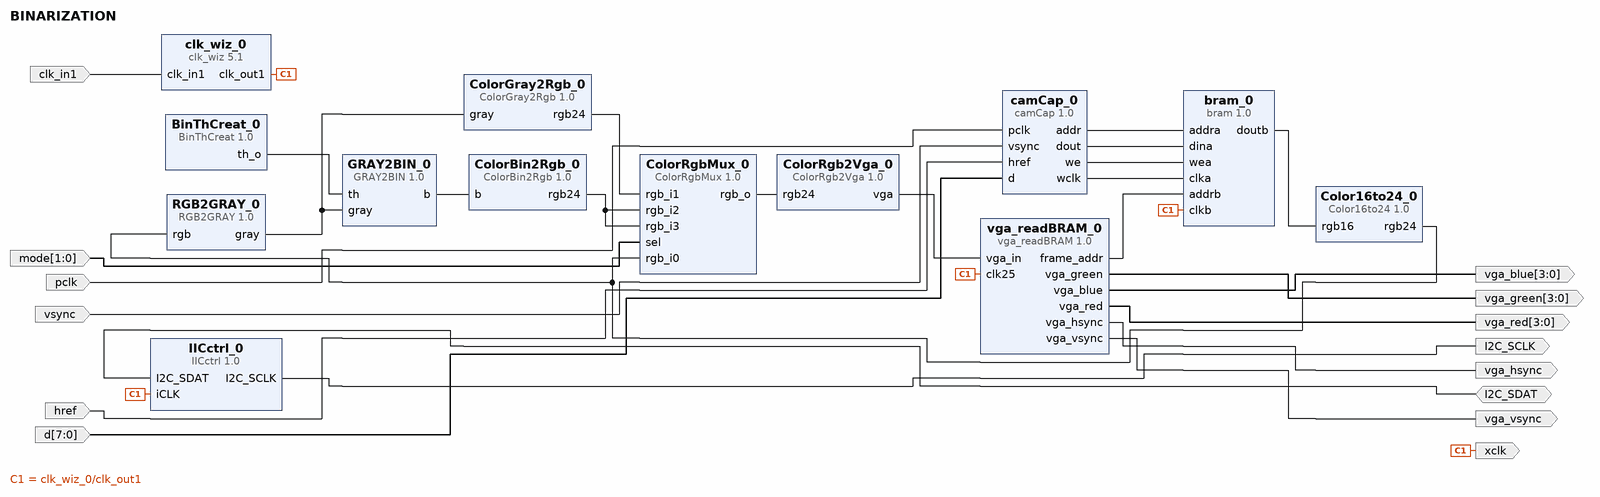
[diagram p0: block diagram of the top level]
# Vivado block design BINARIZATION, Vivado 2014.4
create_bd_design BINARIZATION

create_bd_port -dir O -type clk xclk
create_bd_port -dir I -type clk clk_in1
set_property -dict {CONFIG.FREQ_HZ 100000000} [get_bd_ports clk_in1]
create_bd_port -dir O -from 3 -to 0 vga_red
create_bd_port -dir O -from 3 -to 0 vga_green
create_bd_port -dir O -from 3 -to 0 vga_blue
create_bd_port -dir O vga_hsync
create_bd_port -dir O vga_vsync
create_bd_port -dir I -from 1 -to 0 mode
create_bd_port -dir I pclk
create_bd_port -dir I vsync
create_bd_port -dir I href
create_bd_port -dir I -from 7 -to 0 d
create_bd_port -dir O I2C_SCLK
create_bd_port -dir IO I2C_SDAT

create_bd_cell -type ip -vlnv xilinx.com:XUP:bram:1.0 bram_0
create_bd_cell -type ip -vlnv xilinx.com:user:vga_readBRAM:1.0 vga_readBRAM_0
create_bd_cell -type ip -vlnv xilinx.com:ip:clk_wiz:5.1 clk_wiz_0
set_property -dict [list \
  CONFIG.CLKOUT2_USED false \
  CONFIG.NUM_OUT_CLKS 1 \
  CONFIG.CLKOUT1_REQUESTED_OUT_FREQ 25.000 \
  CONFIG.USE_LOCKED false \
  CONFIG.USE_RESET false \
  CONFIG.CLKOUT1_JITTER 320.187 \
  CONFIG.CLKOUT1_PHASE_ERROR 246.739 \
  CONFIG.CLKOUT2_JITTER 130.958 \
  CONFIG.CLKOUT2_PHASE_ERROR 98.575 \
] [get_bd_cells clk_wiz_0]
create_bd_cell -type ip -vlnv dtysky:XUP:Color16to24:1.0 Color16to24_0
create_bd_cell -type ip -vlnv dtysky:XUP:ColorGray2Rgb:1.0 ColorGray2Rgb_0
create_bd_cell -type ip -vlnv dtysky:XUP:ColorBin2Rgb:1.0 ColorBin2Rgb_0
create_bd_cell -type ip -vlnv dtysky:XUP:ColorRgbMux:1.0 ColorRgbMux_0
create_bd_cell -type ip -vlnv dtysky:XUP:RGB2GRAY:1.0 RGB2GRAY_0
create_bd_cell -type ip -vlnv dtysky:XUP:GRAY2BIN:1.0 GRAY2BIN_0
create_bd_cell -type ip -vlnv xilinx.com:XUP:camCap:1.0 camCap_0
create_bd_cell -type ip -vlnv xilinx.com:XUP:IICctrl:1.0 IICctrl_0
create_bd_cell -type ip -vlnv dtysky:XUP:ColorRgb2Vga:1.0 ColorRgb2Vga_0
create_bd_cell -type ip -vlnv xilinx.com:ip:BinThCreat:1.0 BinThCreat_0
set_property -dict {CONFIG.th 128} [get_bd_cells BinThCreat_0]

# ---- connections ----

connect_bd_net [get_bd_pins bram_0/doutb] [get_bd_pins Color16to24_0/rgb16]
connect_bd_net [get_bd_pins Color16to24_0/rgb24] [get_bd_pins ColorRgbMux_0/rgb_i0] [get_bd_pins RGB2GRAY_0/rgb]
connect_bd_net [get_bd_pins RGB2GRAY_0/gray] [get_bd_pins ColorGray2Rgb_0/gray] [get_bd_pins GRAY2BIN_0/gray]
connect_bd_net [get_bd_pins GRAY2BIN_0/b] [get_bd_pins ColorBin2Rgb_0/b]
connect_bd_net [get_bd_pins ColorRgb2Vga_0/vga] [get_bd_pins vga_readBRAM_0/vga_in]
connect_bd_net [get_bd_pins clk_wiz_0/clk_out1] \
  [get_bd_ports xclk] [get_bd_pins bram_0/clkb] [get_bd_pins vga_readBRAM_0/clk25] [get_bd_pins IICctrl_0/iCLK]
connect_bd_net [get_bd_pins vga_readBRAM_0/frame_addr] [get_bd_pins bram_0/addrb]
connect_bd_net -net clk_in1_1 [get_bd_ports clk_in1] [get_bd_pins clk_wiz_0/clk_in1]
connect_bd_net [get_bd_pins vga_readBRAM_0/vga_red] [get_bd_ports vga_red]
connect_bd_net [get_bd_pins vga_readBRAM_0/vga_green] [get_bd_ports vga_green]
connect_bd_net [get_bd_pins vga_readBRAM_0/vga_blue] [get_bd_ports vga_blue]
connect_bd_net [get_bd_pins vga_readBRAM_0/vga_hsync] [get_bd_ports vga_hsync]
connect_bd_net [get_bd_pins vga_readBRAM_0/vga_vsync] [get_bd_ports vga_vsync]
connect_bd_net [get_bd_pins ColorBin2Rgb_0/rgb24] [get_bd_pins ColorRgbMux_0/rgb_i2] [get_bd_pins ColorRgbMux_0/rgb_i3]
connect_bd_net [get_bd_pins ColorGray2Rgb_0/rgb24] [get_bd_pins ColorRgbMux_0/rgb_i1]
connect_bd_net [get_bd_pins ColorRgbMux_0/rgb_o] [get_bd_pins ColorRgb2Vga_0/rgb24]
connect_bd_net [get_bd_ports mode] [get_bd_pins ColorRgbMux_0/sel]
connect_bd_net [get_bd_ports pclk] [get_bd_pins camCap_0/pclk]
connect_bd_net [get_bd_ports vsync] [get_bd_pins camCap_0/vsync]
connect_bd_net [get_bd_ports href] [get_bd_pins camCap_0/href]
connect_bd_net [get_bd_ports d] [get_bd_pins camCap_0/d]
connect_bd_net [get_bd_pins IICctrl_0/I2C_SCLK] [get_bd_ports I2C_SCLK]
connect_bd_net [get_bd_ports I2C_SDAT] [get_bd_pins IICctrl_0/I2C_SDAT]
connect_bd_net [get_bd_pins camCap_0/addr] [get_bd_pins bram_0/addra]
connect_bd_net [get_bd_pins camCap_0/dout] [get_bd_pins bram_0/dina]
connect_bd_net [get_bd_pins camCap_0/we] [get_bd_pins bram_0/wea]
connect_bd_net [get_bd_pins camCap_0/wclk] [get_bd_pins bram_0/clka]
connect_bd_net [get_bd_pins BinThCreat_0/th_o] [get_bd_pins GRAY2BIN_0/th]

validate_bd_design
save_bd_design
